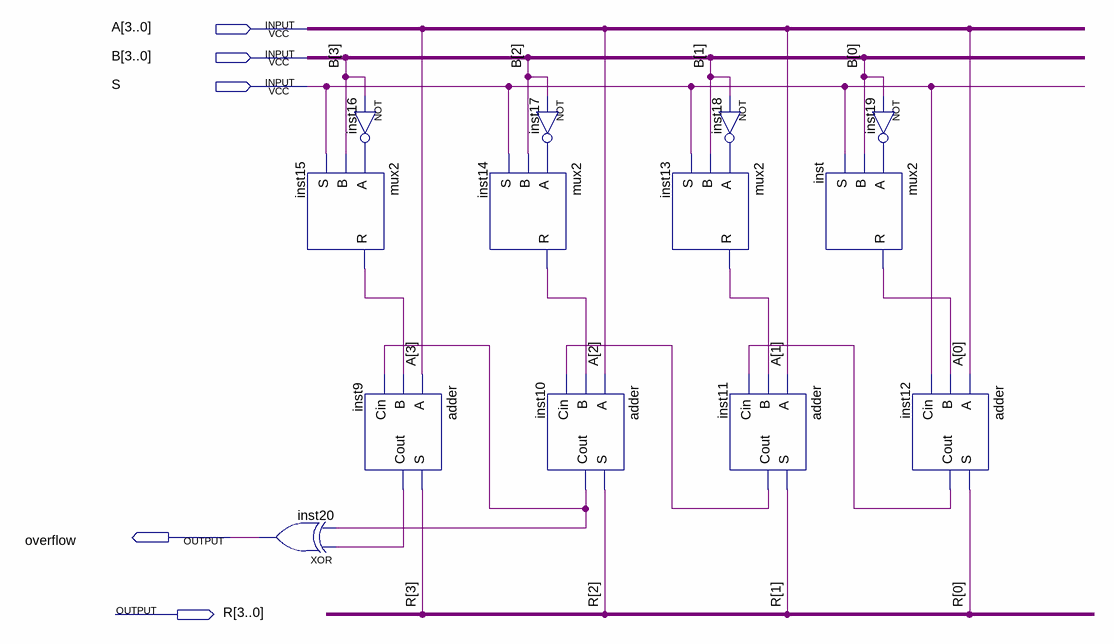
[diagram p0: schematic sheet]
// Quartus schematic somador_subtracter.bdf as structural Verilog: 13 symbols, 5 pins
module somador_subtracter (
  input  [3:0] A,
  input  [3:0] B,
  input  S,
  output overflow,
  output [3:0] R
);

  wire inst9_cout, inst10_cout, inst11_cout, inst12_cout, inst13_r, inst14_r, inst15_r, inst16_out,
       inst17_out, inst18_out, inst19_out, inst_r;

  mux2 inst15 (.A(inst16_out), .B(B[3]), .S(S), .R(inst15_r));
  xor inst20 (overflow, inst9_cout, inst10_cout);
  not inst16 (inst16_out, B[3]);
  adder inst9 (.A(A[3]), .B(inst15_r), .Cin(inst10_cout), .S(R[3]), .Cout(inst9_cout));
  mux2 inst14 (.A(inst17_out), .B(B[2]), .S(S), .R(inst14_r));
  not inst17 (inst17_out, B[2]);
  adder inst10 (.A(A[2]), .B(inst14_r), .Cin(inst11_cout), .S(R[2]), .Cout(inst10_cout));
  not inst18 (inst18_out, B[1]);
  mux2 inst13 (.A(inst18_out), .B(B[1]), .S(S), .R(inst13_r));
  adder inst11 (.A(A[1]), .B(inst13_r), .Cin(inst12_cout), .S(R[1]), .Cout(inst11_cout));
  not inst19 (inst19_out, B[0]);
  mux2 inst (.A(inst19_out), .B(B[0]), .S(S), .R(inst_r));
  adder inst12 (.A(A[0]), .B(inst_r), .Cin(S), .S(R[0]), .Cout(inst12_cout));
endmodule
